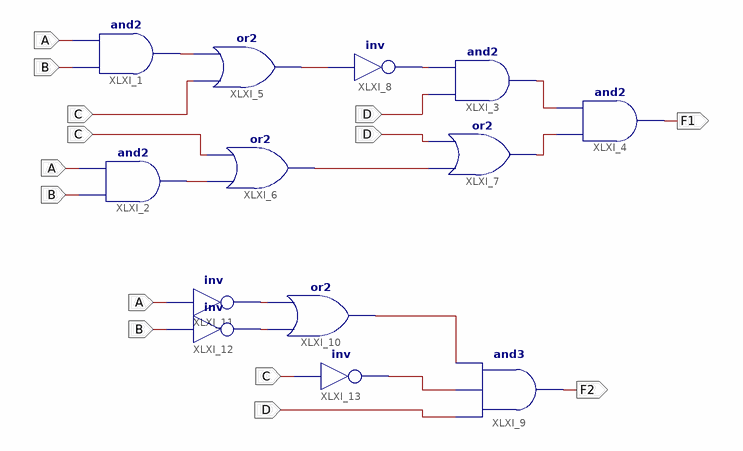
[diagram p0: schematic sheet 1]
// Xilinx ISE schematic problem1.sch (spartan3e) as structural Verilog: 13 symbols, 6 ports
module problem1 (
  input  A,
  input  B,
  input  C,
  input  D,
  output F1,
  output F2
);

  wire XLXN_1, XLXN_2, XLXN_3, XLXN_5, XLXN_6, XLXN_7, XLXN_8, XLXN_26, XLXN_27, XLXN_28, XLXN_29;

  and XLXI_1 (XLXN_1, B, A);
  and XLXI_2 (XLXN_2, B, A);
  and XLXI_3 (XLXN_7, D, XLXN_6);
  and XLXI_4 (F1, XLXN_8, XLXN_7);
  or XLXI_5 (XLXN_5, C, XLXN_1);
  or XLXI_6 (XLXN_3, XLXN_2, C);
  or XLXI_7 (XLXN_8, XLXN_3, D);
  not XLXI_8 (XLXN_6, XLXN_5);
  or XLXI_10 (XLXN_28, XLXN_27, XLXN_26);
  not XLXI_11 (XLXN_26, A);
  not XLXI_12 (XLXN_27, B);
  and XLXI_9 (F2, D, XLXN_29, XLXN_28);
  not XLXI_13 (XLXN_29, C);
endmodule
